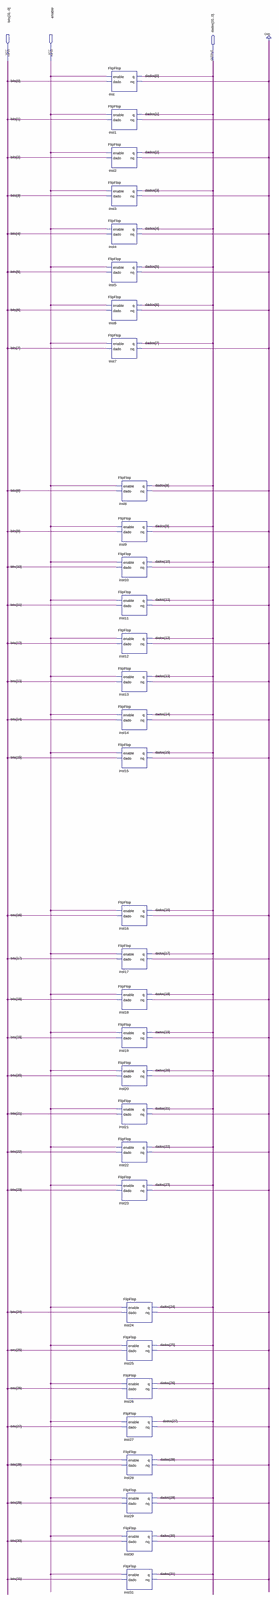
[diagram p0: schematic sheet, whole]
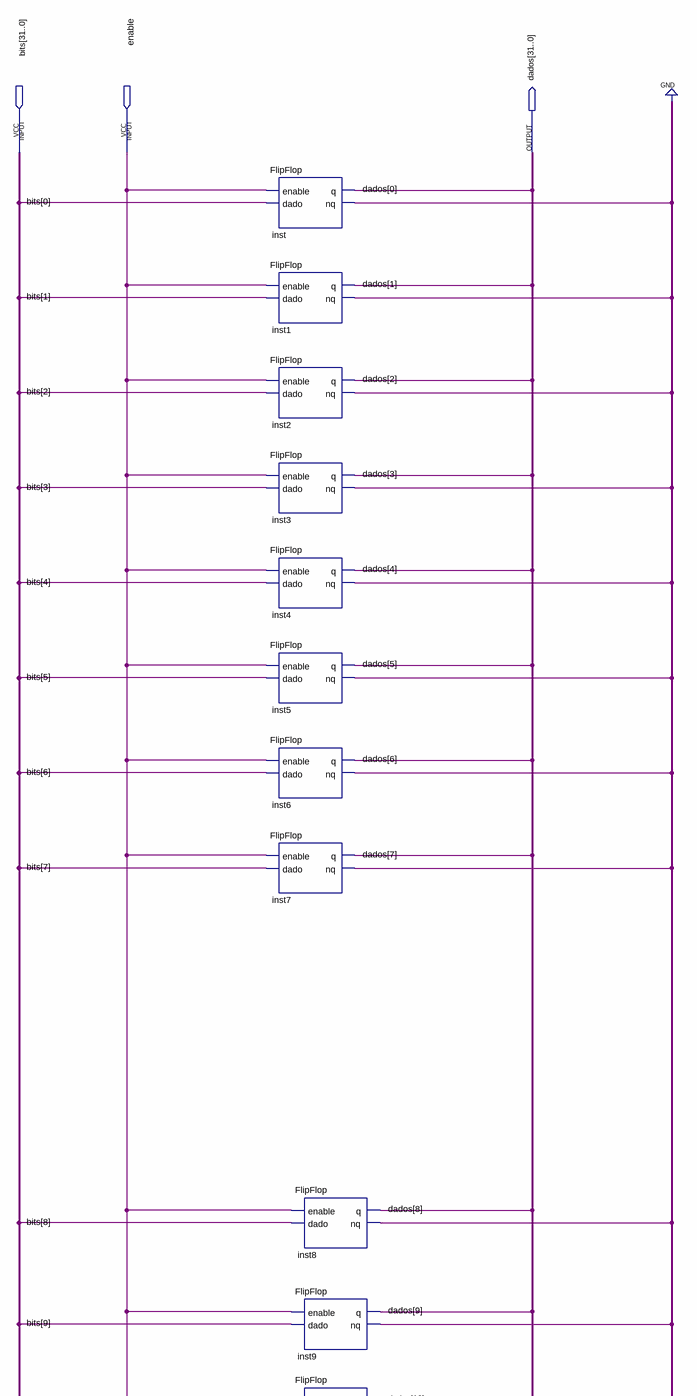
[diagram p1: schematic sheet, upper part]
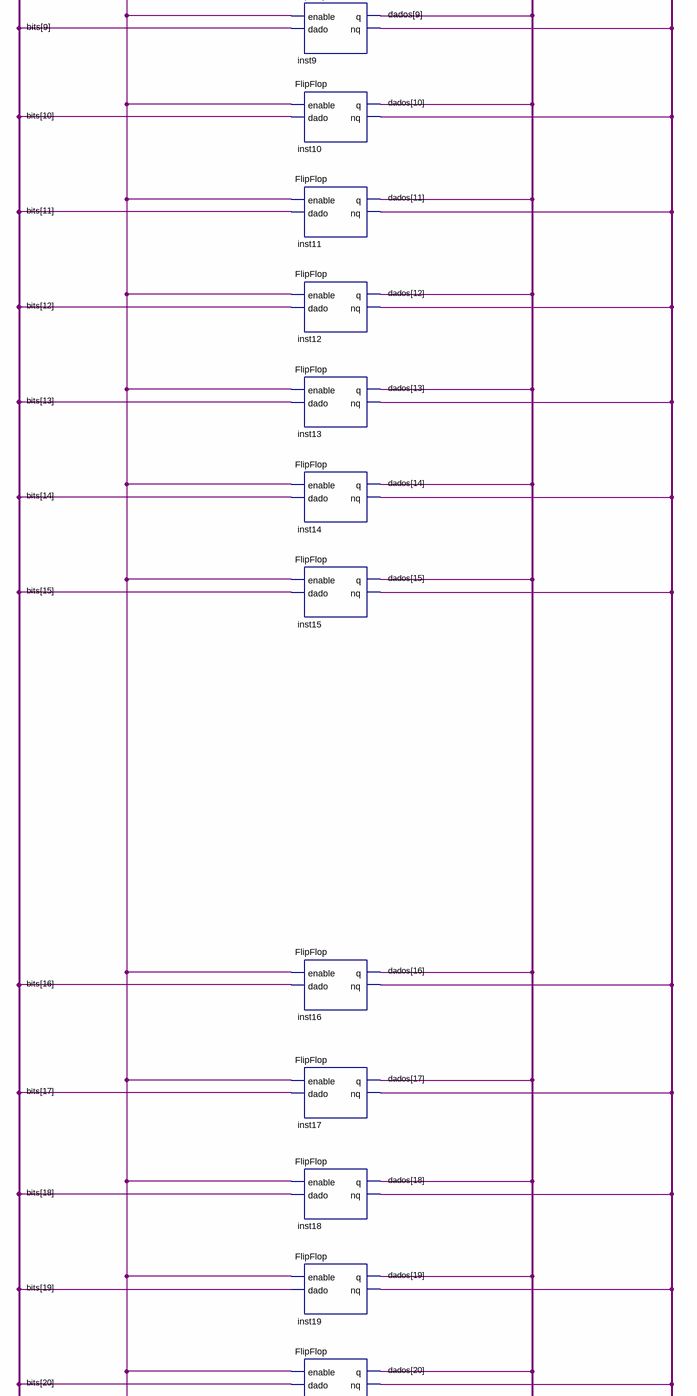
[diagram p2: schematic sheet, middle part]
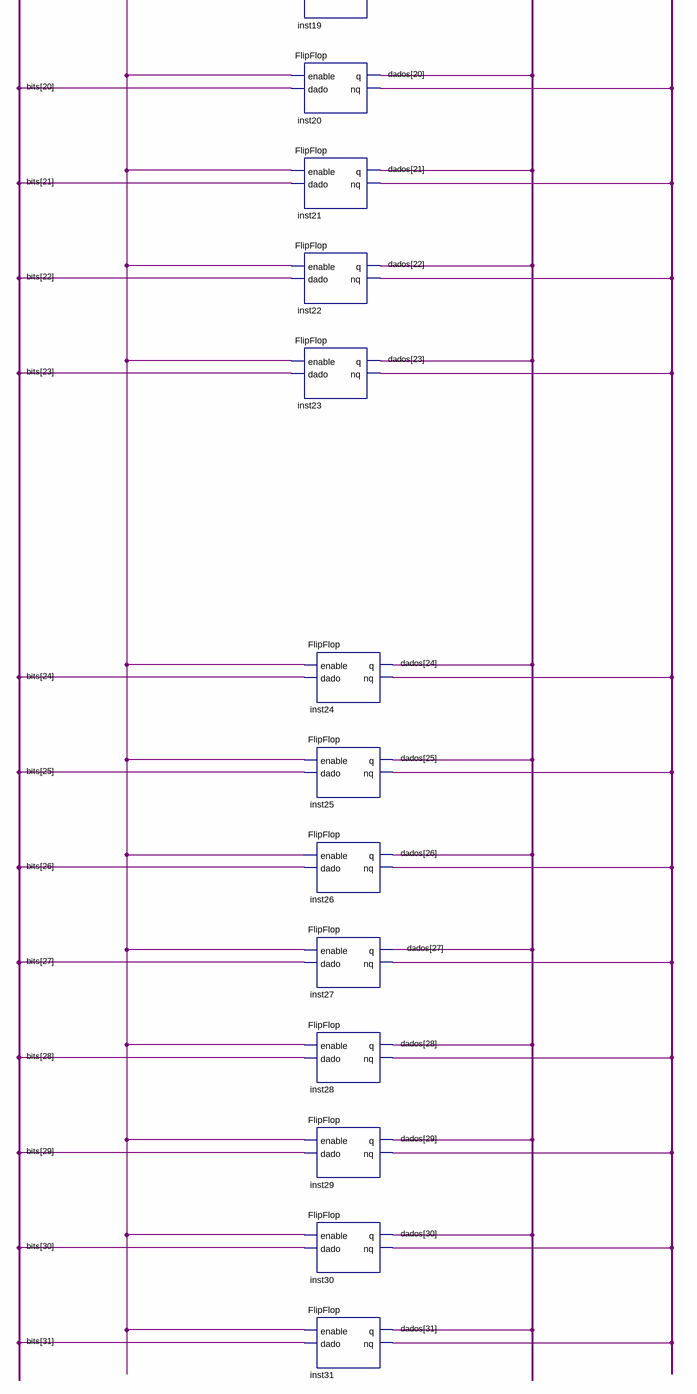
[diagram p3: schematic sheet, lower part]
// Quartus schematic Registrador.bdf as structural Verilog: 32 symbols, 3 pins
module Registrador (
  input  [31:0] bits,
  input  enable,
  output [31:0] dados
);

  wire inst_nq;

  FlipFlop inst (.enable(enable), .dado(bits[0]), .q(dados[0]), .nq(inst_nq));
  FlipFlop inst1 (.enable(enable), .dado(bits[1]), .q(dados[1]), .nq(inst_nq));
  FlipFlop inst2 (.enable(enable), .dado(bits[2]), .q(dados[2]), .nq(inst_nq));
  FlipFlop inst3 (.enable(enable), .dado(bits[3]), .q(dados[3]), .nq(inst_nq));
  FlipFlop inst4 (.enable(enable), .dado(bits[4]), .q(dados[4]), .nq(inst_nq));
  FlipFlop inst5 (.enable(enable), .dado(bits[5]), .q(dados[5]), .nq(inst_nq));
  FlipFlop inst6 (.enable(enable), .dado(bits[6]), .q(dados[6]), .nq(inst_nq));
  FlipFlop inst7 (.enable(enable), .dado(bits[7]), .q(dados[7]), .nq(inst_nq));
  FlipFlop inst8 (.enable(enable), .dado(bits[8]), .q(dados[8]), .nq(inst_nq));
  FlipFlop inst9 (.enable(enable), .dado(bits[9]), .q(dados[9]), .nq(inst_nq));
  FlipFlop inst10 (.enable(enable), .dado(bits[10]), .q(dados[10]), .nq(inst_nq));
  FlipFlop inst11 (.enable(enable), .dado(bits[11]), .q(dados[11]), .nq(inst_nq));
  FlipFlop inst12 (.enable(enable), .dado(bits[12]), .q(dados[12]), .nq(inst_nq));
  FlipFlop inst13 (.enable(enable), .dado(bits[13]), .q(dados[13]), .nq(inst_nq));
  FlipFlop inst14 (.enable(enable), .dado(bits[14]), .q(dados[14]), .nq(inst_nq));
  FlipFlop inst15 (.enable(enable), .dado(bits[15]), .q(dados[15]), .nq(inst_nq));
  FlipFlop inst16 (.enable(enable), .dado(bits[16]), .q(dados[16]), .nq(inst_nq));
  FlipFlop inst17 (.enable(enable), .dado(bits[17]), .q(dados[17]), .nq(inst_nq));
  FlipFlop inst18 (.enable(enable), .dado(bits[18]), .q(dados[18]), .nq(inst_nq));
  FlipFlop inst19 (.enable(enable), .dado(bits[19]), .q(dados[19]), .nq(inst_nq));
  FlipFlop inst20 (.enable(enable), .dado(bits[20]), .q(dados[20]), .nq(inst_nq));
  FlipFlop inst21 (.enable(enable), .dado(bits[21]), .q(dados[21]), .nq(inst_nq));
  FlipFlop inst22 (.enable(enable), .dado(bits[22]), .q(dados[22]), .nq(inst_nq));
  FlipFlop inst23 (.enable(enable), .dado(bits[23]), .q(dados[23]), .nq(inst_nq));
  FlipFlop inst24 (.enable(enable), .dado(bits[24]), .q(dados[24]), .nq(inst_nq));
  FlipFlop inst25 (.enable(enable), .dado(bits[25]), .q(dados[25]), .nq(inst_nq));
  FlipFlop inst26 (.enable(enable), .dado(bits[26]), .q(dados[26]), .nq(inst_nq));
  FlipFlop inst27 (.enable(enable), .dado(bits[27]), .q(dados[27]), .nq(inst_nq));
  FlipFlop inst28 (.enable(enable), .dado(bits[28]), .q(dados[28]), .nq(inst_nq));
  FlipFlop inst29 (.enable(enable), .dado(bits[29]), .q(dados[29]), .nq(inst_nq));
  FlipFlop inst30 (.enable(enable), .dado(bits[30]), .q(dados[30]), .nq(inst_nq));
  FlipFlop inst31 (.enable(enable), .dado(bits[31]), .q(dados[31]), .nq(inst_nq));
  // also tied to GND on the sheet: inst_nq
endmodule
